# Altium schematic sheet sheet1_overview.SchDoc: Proximo: Overview
size A4; Organization: Ideetron B.V.; Address1: Dorpstraat 81; Address2: 3941 JL Doorn; Address3: 3941 JL Doorn; Address4: The Netherlands; SheetNumber: 1
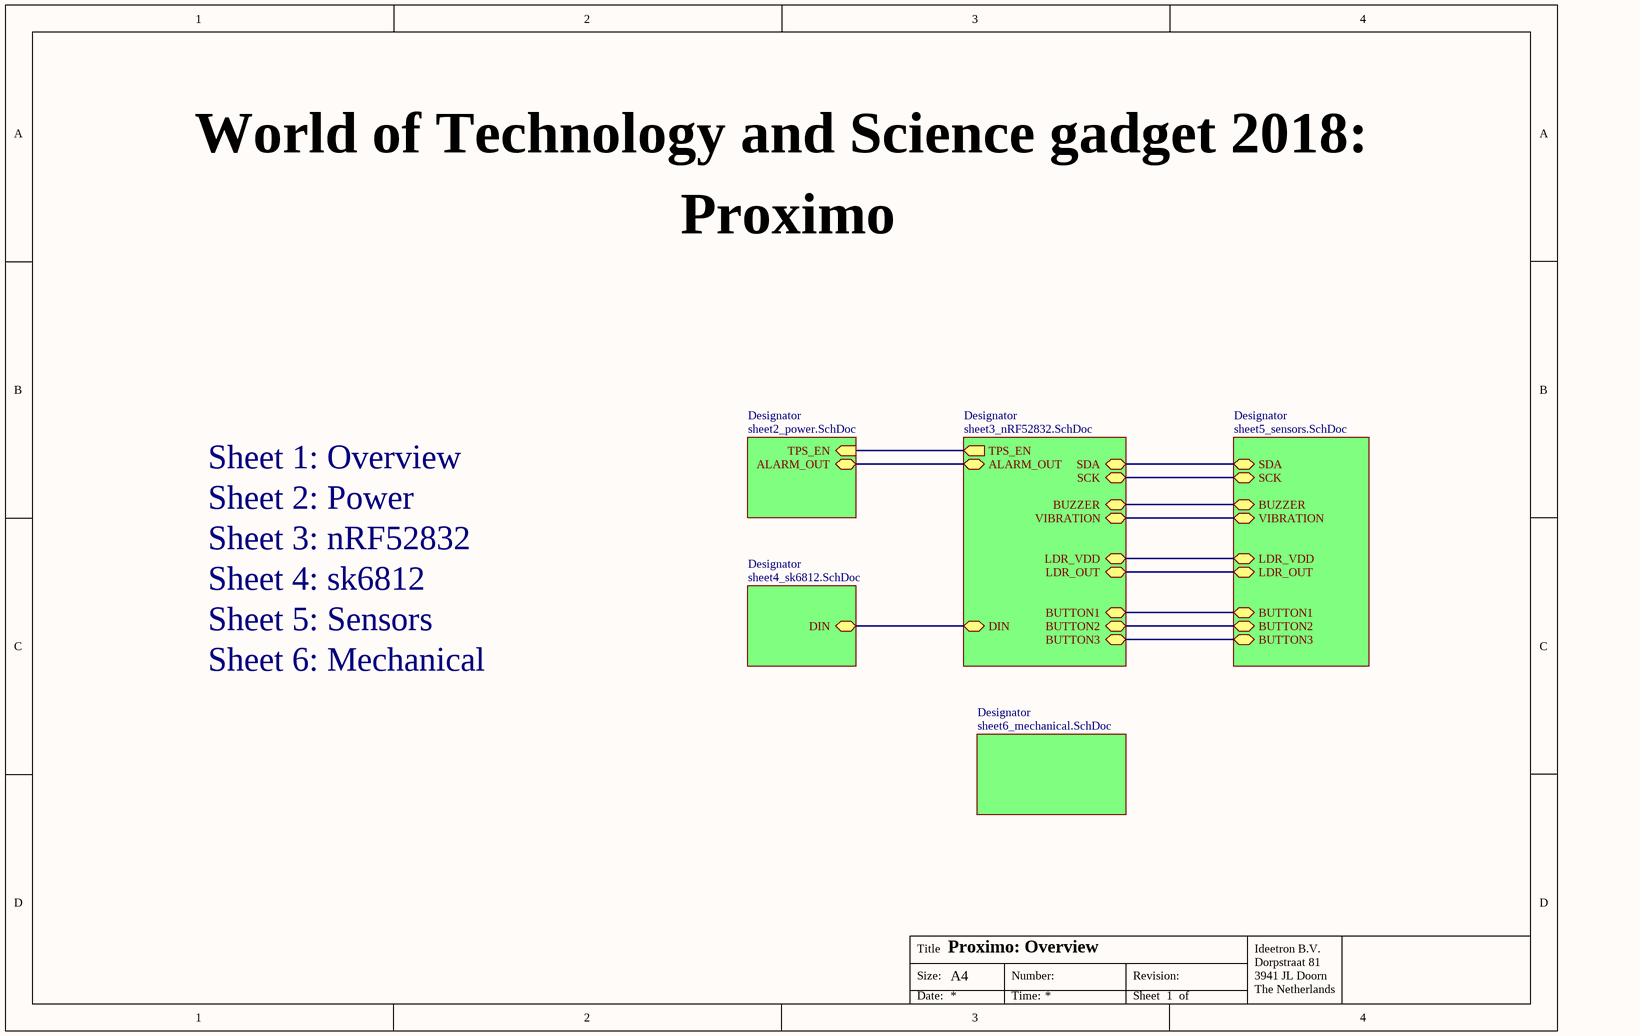
[diagram p0: sheet1_overview.SchDoc]

## Sub-sheets
Designator = sheet2_power.SchDoc: ALARM_OUT (bidir), TPS_EN (in)
Designator = sheet3_nRF52832.SchDoc: TPS_EN (out), DIN (bidir), ALARM_OUT (bidir), BUZZER (bidir), VIBRATION (bidir), LDR_OUT (bidir), LDR_VDD (bidir), SDA (bidir), SCK (bidir), BUTTON3 (bidir), BUTTON2 (bidir), BUTTON1 (bidir)
Designator = sheet5_sensors.SchDoc: LDR_OUT (bidir), BUZZER (bidir), VIBRATION (bidir), SDA (bidir), LDR_VDD (bidir), BUTTON1 (bidir), BUTTON3 (bidir), SCK (bidir), BUTTON2 (bidir)
Designator = sheet4_sk6812.SchDoc: DIN (bidir)
Designator = sheet6_mechanical.SchDoc: no entries

## Nets
(unnamed): sheet Designator/ALARM_OUT, sheet Designator/ALARM_OUT
(unnamed): sheet Designator/TPS_EN, sheet Designator/TPS_EN
(unnamed): sheet Designator/DIN, sheet Designator/DIN
(unnamed): sheet Designator/BUZZER, sheet Designator/BUZZER
(unnamed): sheet Designator/VIBRATION, sheet Designator/VIBRATION
(unnamed): sheet Designator/LDR_OUT, sheet Designator/LDR_OUT
(unnamed): sheet Designator/LDR_VDD, sheet Designator/LDR_VDD
(unnamed): sheet Designator/SDA, sheet Designator/SDA
(unnamed): sheet Designator/SCK, sheet Designator/SCK
(unnamed): sheet Designator/BUTTON3, sheet Designator/BUTTON3
(unnamed): sheet Designator/BUTTON2, sheet Designator/BUTTON2
(unnamed): sheet Designator/BUTTON1, sheet Designator/BUTTON1

## Notes on the sheet
- World of Technology and Science gadget 2018:
- Proximo
- Sheet 1: Overview
- Sheet 2: Power
- Sheet 3: nRF52832
- Sheet 4: sk6812
- Sheet 5: Sensors
- Sheet 6: Mechanical
- Title
- Size:
- A4
- Number:
- Revision:
- Date:
- Time:
- Sheet
- of